# EAGLE design MASTER (EAGLE 7.7.0)
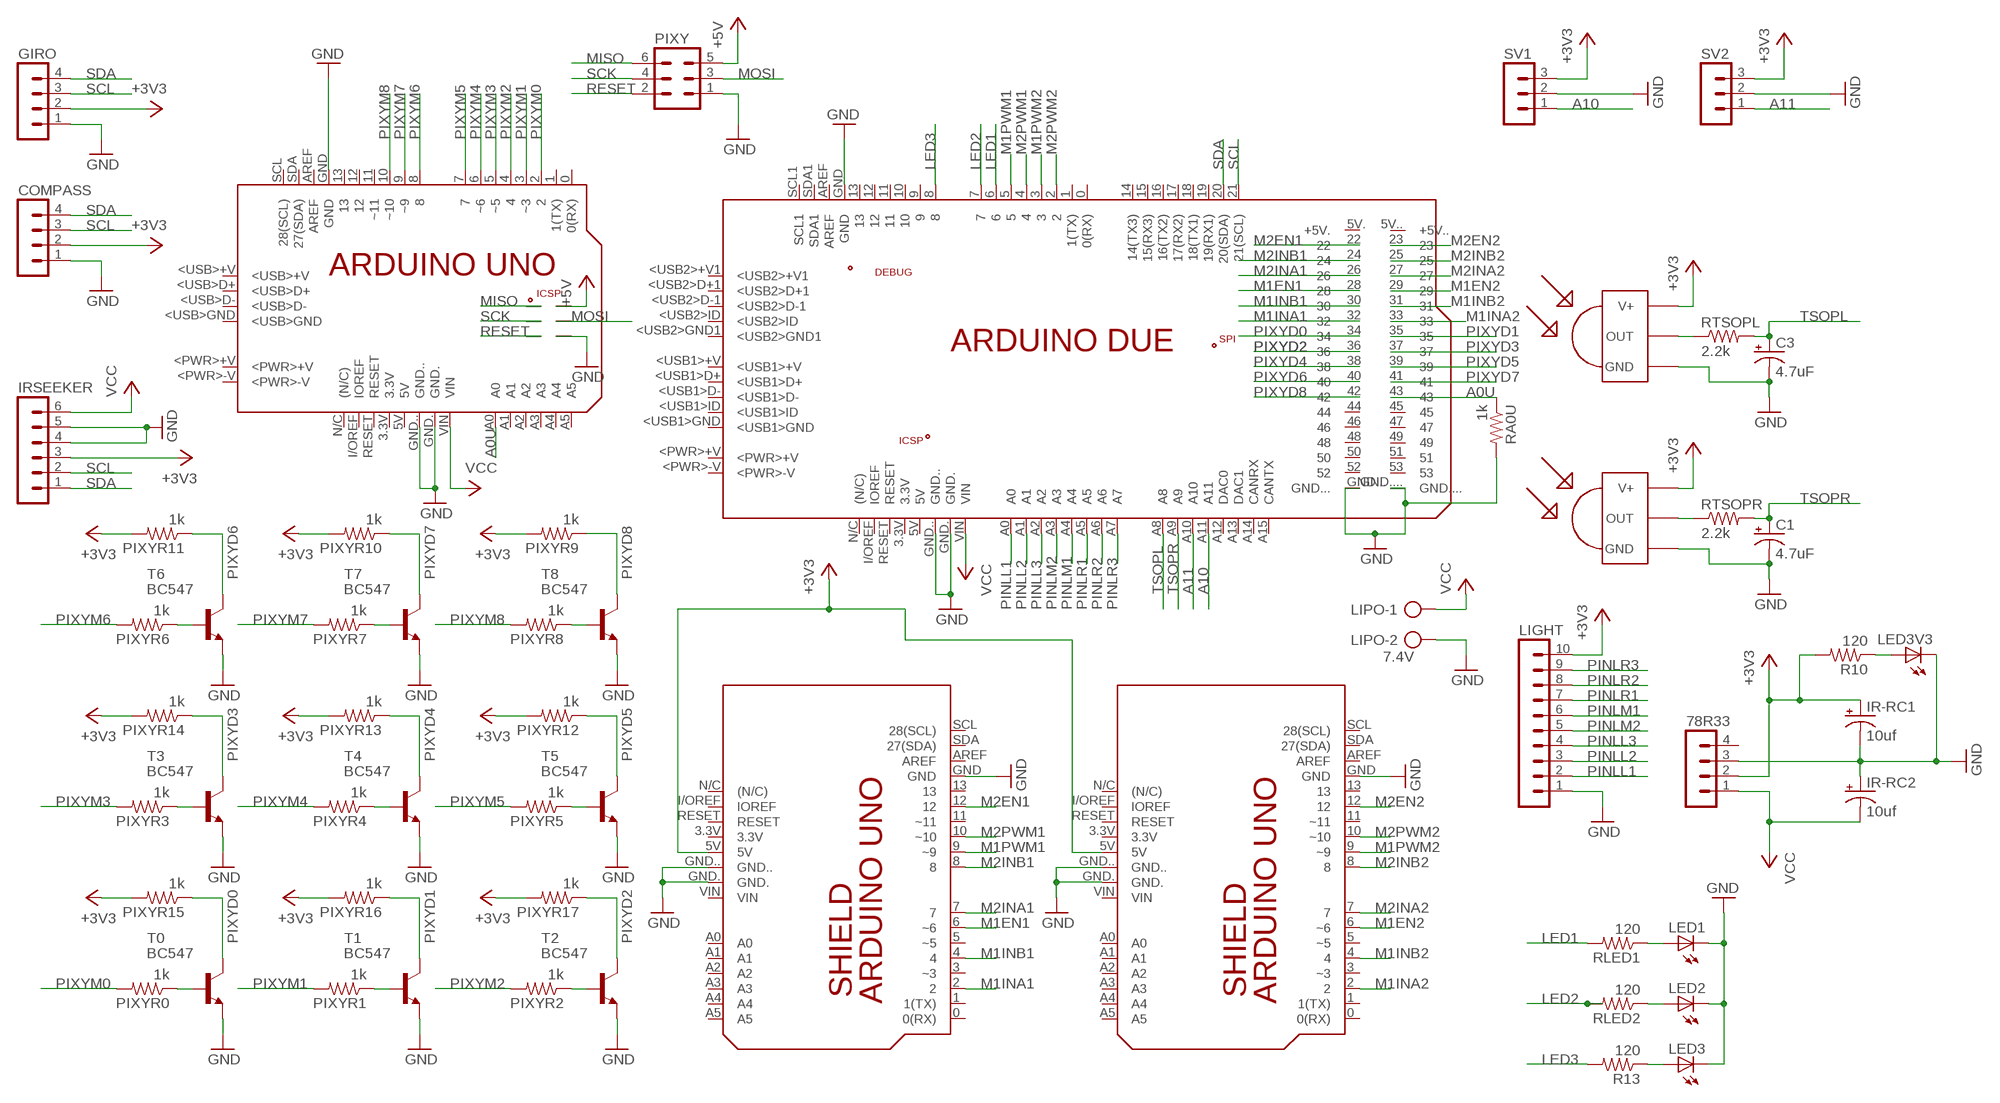
[diagram p0: schematic, sheet 1]

## Parts
78R33  MA04-1  [MA04-1]
C1  4.7uF  CPOL-USE5-6  [E5-6]
C3  4.7uF  CPOL-USE5-6  [E5-6]
COMPASS  MA04-1  [MA04-1]
GIRO  MA04-1  [MA04-1]
IR-RC1  10uf  CPOL-USE5-6  [E5-6]
IR-RC2  10uf  CPOL-USE5-6  [E5-6]
IRSEEKER  MA06-1  [MA06-1]
LED1  LED5MM  [LED5MM]
LED2  LED5MM  [LED5MM]
LED3  LED5MM  [LED5MM]
LED3V3  LED5MM  [LED5MM]
LIGHT  MA10-1  [MA10-1]
LIPO  7.4V  AK500/2  [AK500/2]
PCB3  ARDUINO_DUE  [ARDUINO_DUE]
PCB4  ARDUINO_UNO  [ARDUINO_UNO]
PIXY  MA03-2  [MA03-2]
PIXYR0  1k  R-US_0411/15  [0411/15]
PIXYR1  1k  R-US_0411/15  [0411/15]
PIXYR2  1k  R-US_0411/15  [0411/15]
PIXYR3  1k  R-US_0411/15  [0411/15]
PIXYR4  1k  R-US_0411/15  [0411/15]
PIXYR5  1k  R-US_0411/15  [0411/15]
PIXYR6  1k  R-US_0411/15  [0411/15]
PIXYR7  1k  R-US_0411/15  [0411/15]
PIXYR8  1k  R-US_0411/15  [0411/15]
PIXYR9  1k  R-US_0411/15  [0411/15]
PIXYR10  1k  R-US_0411/15  [0411/15]
PIXYR11  1k  R-US_0411/15  [0411/15]
PIXYR12  1k  R-US_0411/15  [0411/15]
PIXYR13  1k  R-US_0411/15  [0411/15]
PIXYR14  1k  R-US_0411/15  [0411/15]
PIXYR15  1k  R-US_0411/15  [0411/15]
PIXYR16  1k  R-US_0411/15  [0411/15]
PIXYR17  1k  R-US_0411/15  [0411/15]
PUENTE  SHIELD_UNO  [SHIELD_UNO]
PUENTE2  SHIELD_UNO  [SHIELD_UNO]
R10  120  R-US_0411/15  [0411/15]
R13  120  R-US_0411/15  [0411/15]
RA0U  1k  R-US_0411/15  [0411/15]
RLED1  120  R-US_0411/15  [0411/15]
RLED2  120  R-US_0411/15  [0411/15]
RTSOPL  2.2k  R-US_0411/15  [0411/15]
RTSOPR  2.2k  R-US_0411/15  [0411/15]
SV1  MA03-1  [MA03-1]
SV2  MA03-1  [MA03-1]
T0  BC547  [TO92]
T1  BC547  [TO92]
T2  BC547  [TO92]
T3  BC547  [TO92]
T4  BC547  [TO92]
T5  BC547  [TO92]
T6  BC547  [TO92]
T7  BC547  [TO92]
T8  BC547  [TO92]
TSOPL  TSOP2240  [TSOP22XX]
TSOPR  TSOP2240  [TSOP22XX]

## Nets
+3V3: 78R33.2 COMPASS.2 GIRO.2 IR-RC1.+ IRSEEKER.3 LIGHT.10 PIXYR9.2 PIXYR10.2 PIXYR11.2 PIXYR12.2 PIXYR13.2 PIXYR14.2 PIXYR15.2 PIXYR16.2 PIXYR17.2 PUENTE2.5V PUENTE.5V R10.2 SV1.3 SV2.3 TSOPL.VCC(V+) TSOPR.VCC(V+)
+5V: PCB4.+5V PIXY.5
A0U: PCB3.43 PCB4.A0 RA0U.1
A10: PCB3.A11 SV1.1
A11: PCB3.A10 SV2.1
GND: 78R33.3 C1.- C3.- COMPASS.1 GIRO.1 IR-RC1.- IR-RC2.+ IRSEEKER.4 IRSEEKER.5 LED1.K(C) LED2.K(C) LED3.K(C) LED3V3.K(C) LIGHT.1 LIPO.2 PCB3.GND PCB3.GND. PCB3.GND.. PCB3.GND... PCB3.GND.... PCB4.GND PCB4.GND. PCB4.GND.. PCB4.GND_ PIXY.1 PUENTE2.GND PUENTE2.GND. PUENTE2.GND.. PUENTE.GND PUENTE.GND. PUENTE.GND.. RA0U.2 SV1.2 SV2.2 T0.1(E) T1.1(E) T2.1(E) T3.1(E) T4.1(E) T5.1(E) T6.1(E) T7.1(E) T8.1(E) TSOPL.GND TSOPR.GND
LED1: PCB3.6 RLED1.2
LED2: PCB3.7 RLED2.2
LED3: PCB3.8 R13.2
M1EN1: PCB3.28 PUENTE.6(~6)
M1EN2: PCB3.29 PUENTE2.6(~6)
M1INA1: PCB3.32 PUENTE.2
M1INA2: PCB3.33 PUENTE2.2
M1INB1: PCB3.30 PUENTE.4
M1INB2: PCB3.31 PUENTE2.4
M1PWM1: PCB3.5 PUENTE.9(~9)
M1PWM2: PCB3.3 PUENTE2.9(~9)
M2EN1: PCB3.22 PUENTE.12
M2EN2: PCB3.23 PUENTE2.12
M2INA1: PCB3.26 PUENTE.7
M2INA2: PCB3.27 PUENTE2.7
M2INB1: PCB3.24 PUENTE.8
M2INB2: PCB3.25 PUENTE2.8
M2PWM1: PCB3.4 PUENTE.10(~10)
M2PWM2: PCB3.2 PUENTE2.10(~10)
MISO: PCB4.MISO PIXY.6
MOSI: PCB4.MOSI PIXY.3
N$2: RTSOPR.1 TSOPR.OUT
N$4: LED1.A RLED1.1
N$5: RTSOPL.1 TSOPL.OUT
N$7: PIXYR0.1 T0.2(B)
N$8: PIXYR1.1 T1.2(B)
N$9: PIXYR2.1 T2.2(B)
N$10: PIXYR3.1 T3.2(B)
N$11: PIXYR4.1 T4.2(B)
N$12: PIXYR5.1 T5.2(B)
N$13: PIXYR6.1 T6.2(B)
N$14: PIXYR7.1 T7.2(B)
N$15: PIXYR8.1 T8.2(B)
N$19: LED3V3.A R10.1
PINLL1: LIGHT.2 PCB3.A0
PINLL2: LIGHT.3 PCB3.A1
PINLL3: LIGHT.4 PCB3.A2
PINLM1: LIGHT.6 PCB3.A4
PINLM2: LIGHT.5 PCB3.A3
PINLR1: LIGHT.7 PCB3.A5
PINLR2: LIGHT.8 PCB3.A6
PINLR3: LIGHT.9 PCB3.A7
PIXYD0: PCB3.34 PIXYR15.1 T0.3(C)
PIXYD1: PCB3.35 PIXYR16.1 T1.3(C)
PIXYD2: PCB3.36 PIXYR17.1 T2.3(C)
PIXYD3: PCB3.37 PIXYR14.1 T3.3(C)
PIXYD4: PCB3.38 PIXYR13.1 T4.3(C)
PIXYD5: PCB3.39 PIXYR12.1 T5.3(C)
PIXYD6: PCB3.40 PIXYR11.1 T6.3(C)
PIXYD7: PCB3.41 PIXYR10.1 T7.3(C)
PIXYD8: PCB3.42 PIXYR9.1 T8.3(C)
PIXYM0: PCB4.2 PIXYR0.2
PIXYM1: PCB4.3(~3) PIXYR1.2
PIXYM2: PCB4.4 PIXYR2.2
PIXYM3: PCB4.5(~5) PIXYR3.2
PIXYM4: PCB4.6(~6) PIXYR4.2
PIXYM5: PCB4.7 PIXYR5.2
PIXYM6: PCB4.8 PIXYR6.2
PIXYM7: PCB4.9(~9) PIXYR7.2
PIXYM8: PCB4.10(~10) PIXYR8.2
RESET: PCB4.RESET. PIXY.2
RLED2: LED2.A RLED2.1
RLED3: LED3.A R13.1
SCK: PCB4.SCK PIXY.4
SCL: COMPASS.3 GIRO.3 IRSEEKER.2 PCB3.21(21(SCL))
SDA: COMPASS.4 GIRO.4 IRSEEKER.1 PCB3.20(20(SDA))
TSOPL: C3.+ PCB3.A8 RTSOPL.2
TSOPR: C1.+ PCB3.A9 RTSOPR.2
VCC: 78R33.1 IR-RC2.- IRSEEKER.6 LIPO.1 PCB3.VIN PCB4.VIN
Unconnected: 78R33.4 PCB3.0(0(RX)) PCB3.1(1(TX)) PCB3.3.3V PCB3.5V PCB3.5V.(+5V.) PCB3.5V..(+5V..) PCB3.9 PCB3.10 PCB3.11 PCB3.12 PCB3.13 PCB3.14(14(TX3)) PCB3.15(15(RX3)) PCB3.16(16(TX2)) PCB3.17(17(RX2)) PCB3.18(18(TX1)) PCB3.19(19(RX1)) PCB3.44 PCB3.45 PCB3.46 PCB3.47 PCB3.48 PCB3.49 PCB3.50 PCB3.51 PCB3.52 PCB3.53 PCB3.+5V PCB3.+5V_ PCB3.<PWR>+V PCB3.<PWR>-V PCB3.<USB1>+V PCB3.<USB1>D+ PCB3.<USB1>D- PCB3.<USB1>GND PCB3.<USB1>ID PCB3.<USB2>+V1 PCB3.<USB2>D+1 PCB3.<USB2>D-1 PCB3.<USB2>GND1 PCB3.<USB2>ID PCB3.A12(DAC0) PCB3.A13(DAC1) PCB3.A14(CANRX) PCB3.A15(CANTX) PCB3.AREF PCB3.GND1 PCB3.GND_ PCB3.GND__ PCB3.I/OREF(IOREF) PCB3.MISO PCB3.MISO2 PCB3.MOSI PCB3.MOSI2 PCB3.N/C((N/C)) PCB3.RESET PCB3.RESET2 PCB3.RESET. PCB3.RESET.. PCB3.SCK PCB3.SCK2 PCB3.SCL1 PCB3.SDA1 PCB3.SWCLK PCB3.SWDIO PCB4.0(0(RX)) PCB4.1(1(TX)) PCB4.3.3V PCB4.5V PCB4.11(~11) PCB4.12 PCB4.13 PCB4.<PWR>+V PCB4.<PWR>-V PCB4.<USB>+V PCB4.<USB>D+ PCB4.<USB>D- PCB4.<USB>GND PCB4.A1 PCB4.A2 PCB4.A3 PCB4.A4 PCB4.A5 PCB4.AREF PCB4.I/OREF(IOREF) PCB4.N/C((N/C)) PCB4.RESET PCB4.SCL(28(SCL)) PCB4.SDA(27(SDA)) PUENTE2.0(0(RX)) PUENTE2.1(1(TX)) PUENTE2.3(~3) PUENTE2.3.3V PUENTE2.5(~5) PUENTE2.11(~11) PUENTE2.13 PUENTE2.A0 PUENTE2.A1 PUENTE2.A2 PUENTE2.A3 PUENTE2.A4 PUENTE2.A5 PUENTE2.AREF PUENTE2.I/OREF(IOREF) PUENTE2.N/C((N/C)) PUENTE2.RESET PUENTE2.SCL(28(SCL)) PUENTE2.SDA(27(SDA)) PUENTE2.VIN PUENTE.0(0(RX)) PUENTE.1(1(TX)) PUENTE.3(~3) PUENTE.3.3V PUENTE.5(~5) PUENTE.11(~11) PUENTE.13 PUENTE.A0 PUENTE.A1 PUENTE.A2 PUENTE.A3 PUENTE.A4 PUENTE.A5 PUENTE.AREF PUENTE.I/OREF(IOREF) PUENTE.N/C((N/C)) PUENTE.RESET PUENTE.SCL(28(SCL)) PUENTE.SDA(27(SDA)) PUENTE.VIN

## Library data of the parts
78R33 COMPASS GIRO = con-lstb:MA04-1: PIN HEADER; OC_FARNELL: unknown; OC_NEWARK: unknown
C1 C3 IR-RC1 IR-RC2 = rcl:CPOL-US: POLARIZED CAPACITOR, American symbol
IRSEEKER = con-lstb:MA06-1: PIN HEADER; OC_FARNELL: unknown; OC_NEWARK: unknown
LED1-LED3 LED3V3 = led:LED: LED OSRAM: - CHIPLED LG R971, LG N971, LY N971, LG Q971, LY Q971, LO R971, LY R971 LH N974, LH R974 LS Q976, LO Q976, LY Q976 LO Q996 - Hyper CHIPLED LW Q18S LB Q993, LB Q99A, LB R99A - SideLED LS A670, LO A670, LY A670, LG A670, LP A670 LB A673, LV A673, LT A673, LW A673 LH A674 LY A675 LS A676, LA A676, LO A676, LY A676, LW A676 LS A679, LY A679, LG A679 - Hyper Micro SIDELED® LS Y876, LA Y876, LO Y876, LY Y876 LT Y87S - SmartLED LW L88C, LW L88S LB L89C, LB L89S, LG L890 LS L89K, LO L89K, LY L89K LS L896, LA L896, LO L896, LY L896 - TOPLED LS T670, LO T670, LY T670, LG T670, LP T670 LSG T670, LSP T670, LSY T670, LOP T670, LYG T670 LG T671, LOG T671, LSG T671 LB T673, LV T673, LT T673, LW T673 LH T674 LS T676, LA T676, LO T676, LY T676, LB T676, LH T676, LSB T676, LW T676 LB T67C, LV T67C, LT T67C, LS T67K, LO T67K, LY T67K, LW E67C LS E67B, LA E67B, LO E67B, LY E67B, LB E67C, LV E67C, LT E67C LW T67C LS T679, LY T679, LG T679 LS T770, LO T770, LY T770, LG T770, LP T770 LB T773, LV T773, LT T773, LW T773 LH T774 LS E675, LA E675, LY E675, LS T675 LS T776, LA T776, LO T776, LY T776, LB T776 LHGB T686 LT T68C, LB T68C - Hyper Mini TOPLED® LB M676 - Mini TOPLED Santana® LG M470 LS M47K, LO M47K, LY M47K Source: http://www.osram.convergy.de LUXEON: - LUMILED® LXK2-PW12-R00, LXK2-PW12-S00, LXK2-PW14-U00, LXK2-PW14-V00 LXK2-PM12-R00, LXK2-PM12-S00, LXK2-PM14-U00 LXK2-PE12-Q00, LXK2-PE12-R00, LXK2-PE12-S00, LXK2-PE14-T00, LXK2-PE14-U00 LXK2-PB12-K00, LXK2-PB12-L00, LXK2-PB12-M00, LXK2-PB14-N00, LXK2-PB14-P00, LXK2-PB14-Q00 LXK2-PR12-L00, LXK2-PR12-M00, LXK2-PR14-Q00, LXK2-PR14-R00 LXK2-PD12-Q00, LXK2-PD12-R00, LXK2-PD12-S00 LXK2-PH12-R00, LXK2-PH12-S00 LXK2-PL12-P00, LXK2-PL12-Q00, LXK2-PL12-R00 Source: www.luxeon.com KINGBRIGHT: KA-3528ASYC Source: www.kingbright.com
LIGHT = con-lstb:MA10-1: PIN HEADER; OC_FARNELL: unknown; OC_NEWARK: unknown
LIPO = con-ptr500:AK500/2: CONNECTOR; OC_FARNELL: unknown; OC_NEWARK: unknown
PCB3 = E14_Arduino_revC:ARDUINO_DUE: Device for representing an Arduino Due board with a footprint in an EAGLE design. Created by Dave Young for Element14. More EAGLE documentation at: http://www.element14.com/community/community/knode/cadsoft_eagle
PCB4 = E14_Arduino_revC:ARDUINO_UNO: Device for representing an Arduino Uno board with a footprint in an EAGLE design. Created by Dave Young for Element14. More EAGLE documentation at: http://www.element14.com/community/community/knode/cadsoft_eagle
PIXY = con-lstb:MA03-2: PIN HEADER; OC_FARNELL: unknown; OC_NEWARK: unknown
PIXYR0 PIXYR1-PIXYR17 R10 R13 RA0U RLED1 RLED2 RTSOPL RTSOPR = rcl:R-US_: RESISTOR, American symbol
PUENTE PUENTE2 = E14_Arduino_revC:SHIELD_UNO
SV1 SV2 = con-lstb:MA03-1: PIN HEADER; OC_FARNELL: unknown; OC_NEWARK: unknown
T0 T1-T8 = transistor:BC547: NPN TRANSISTOR
TSOPL TSOPR = tsop:TSOP2240: IR Receiver and Demodulator

## Board
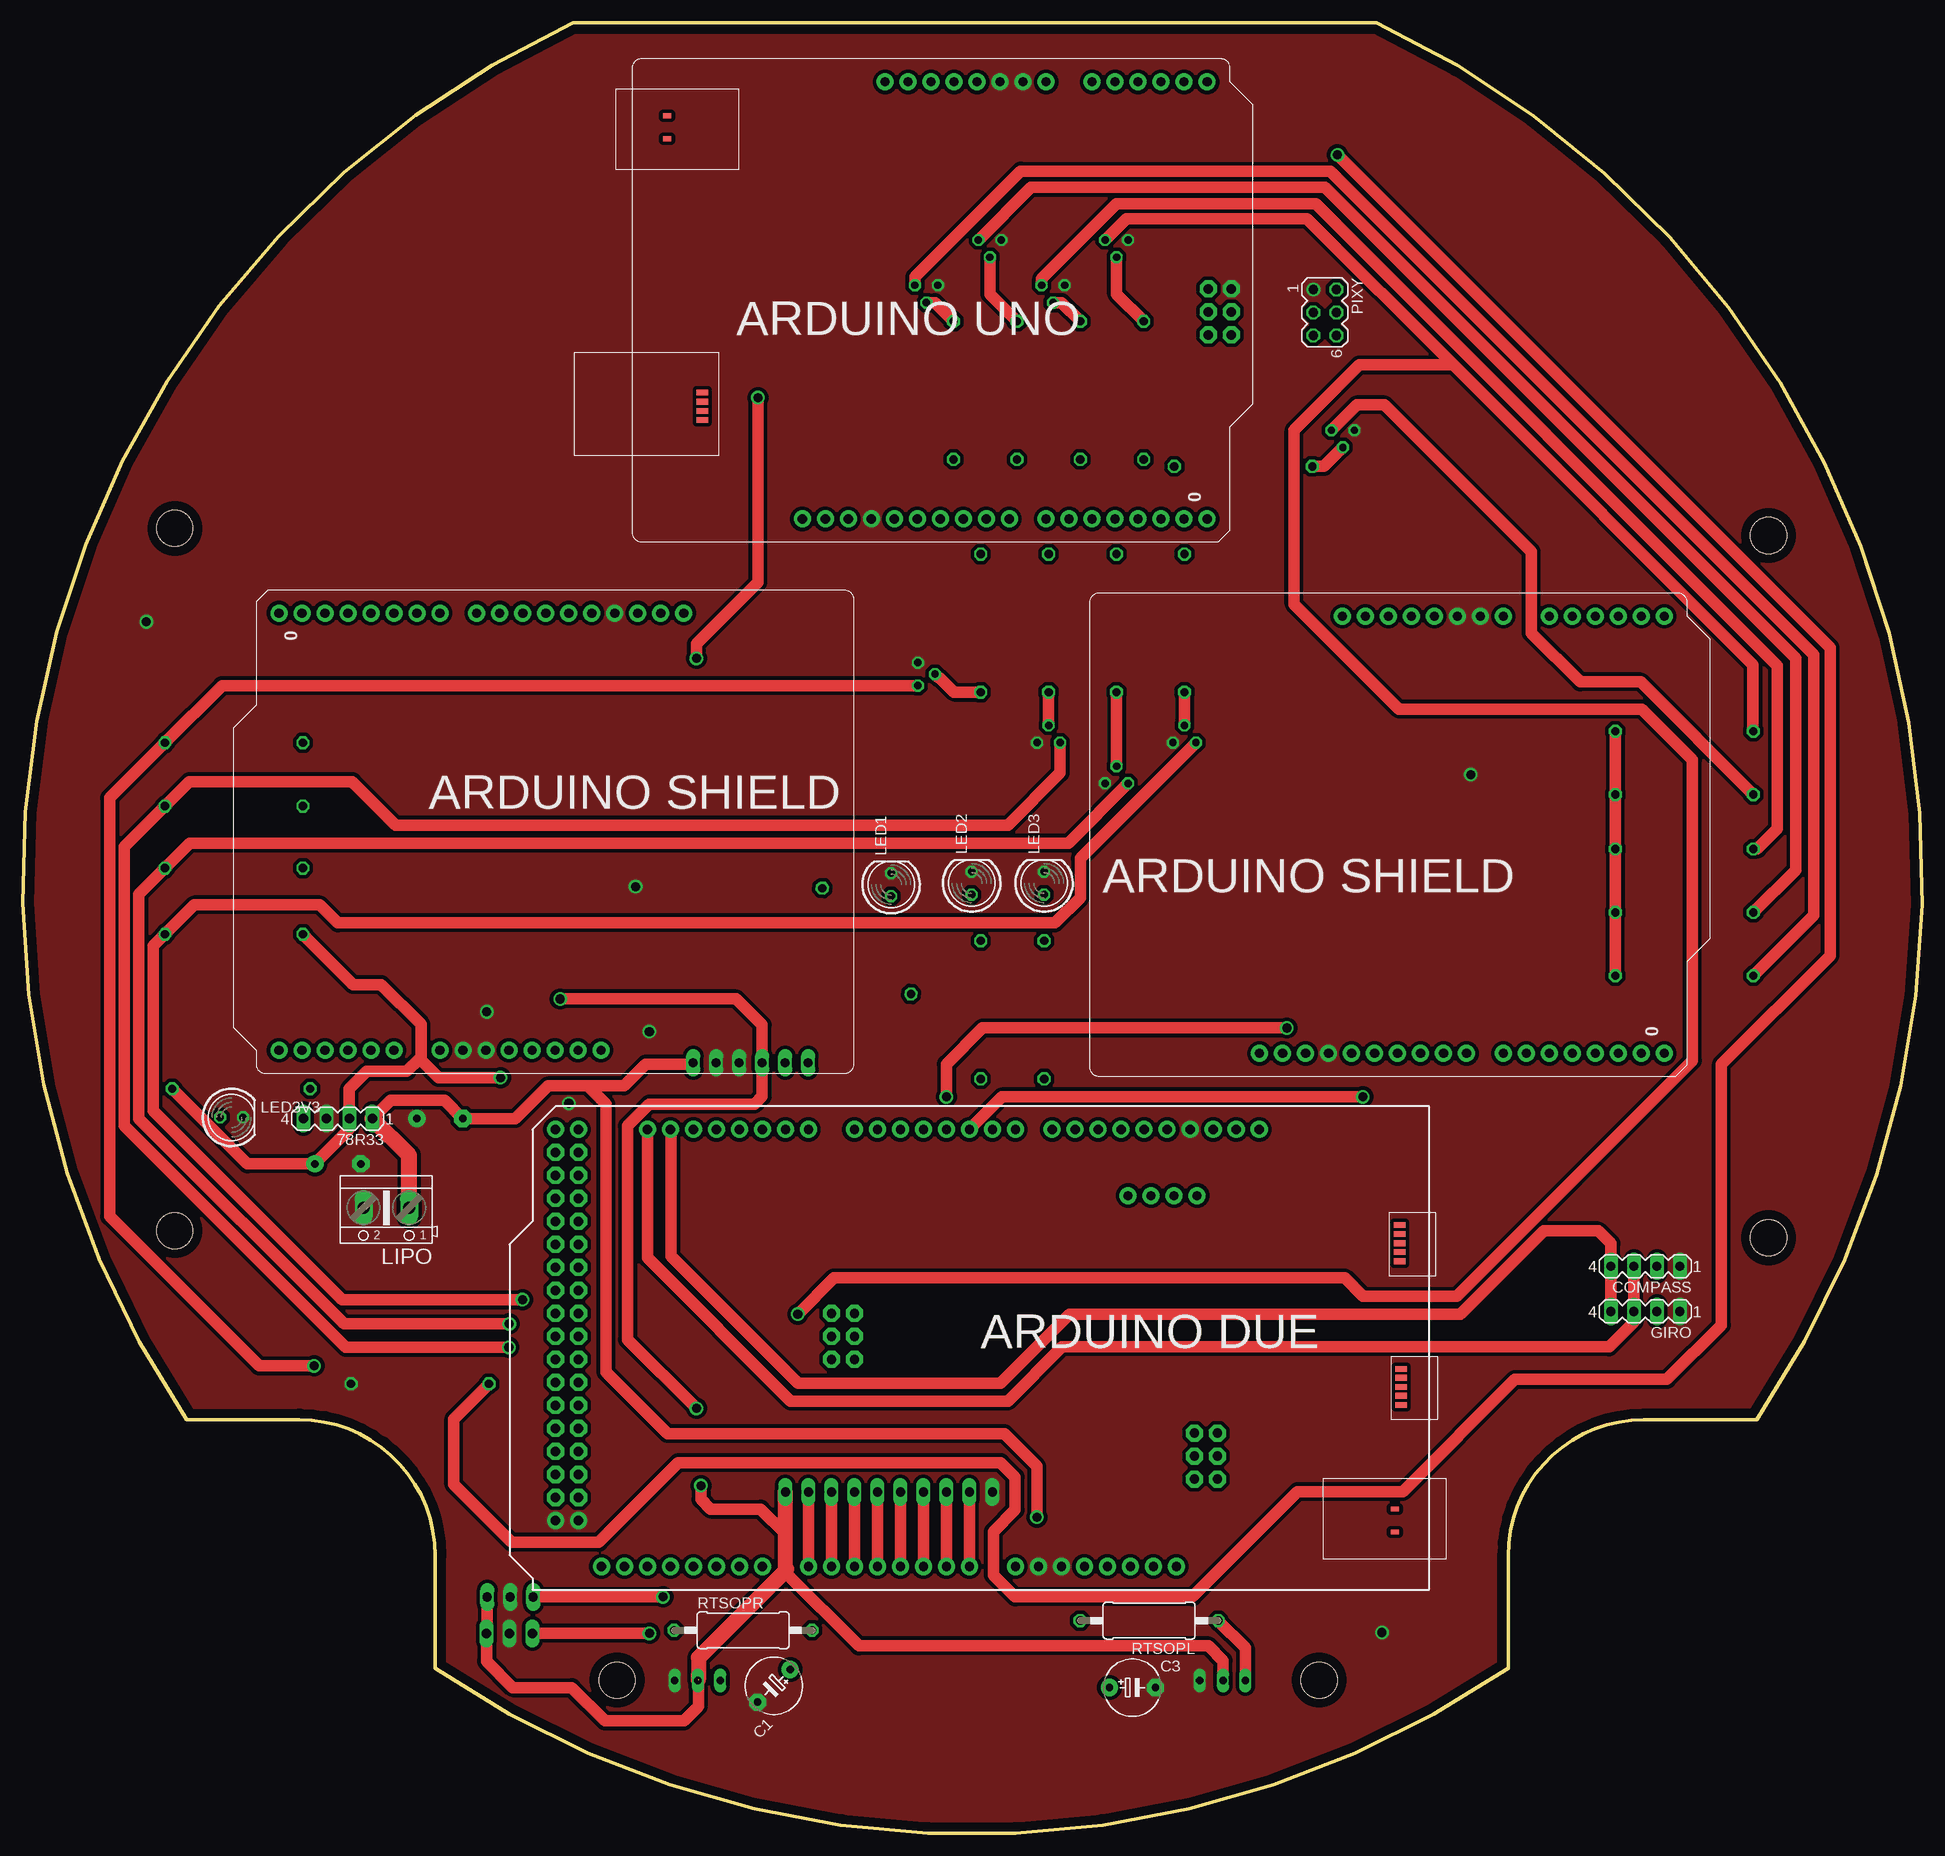
[diagram p1: board, top side]
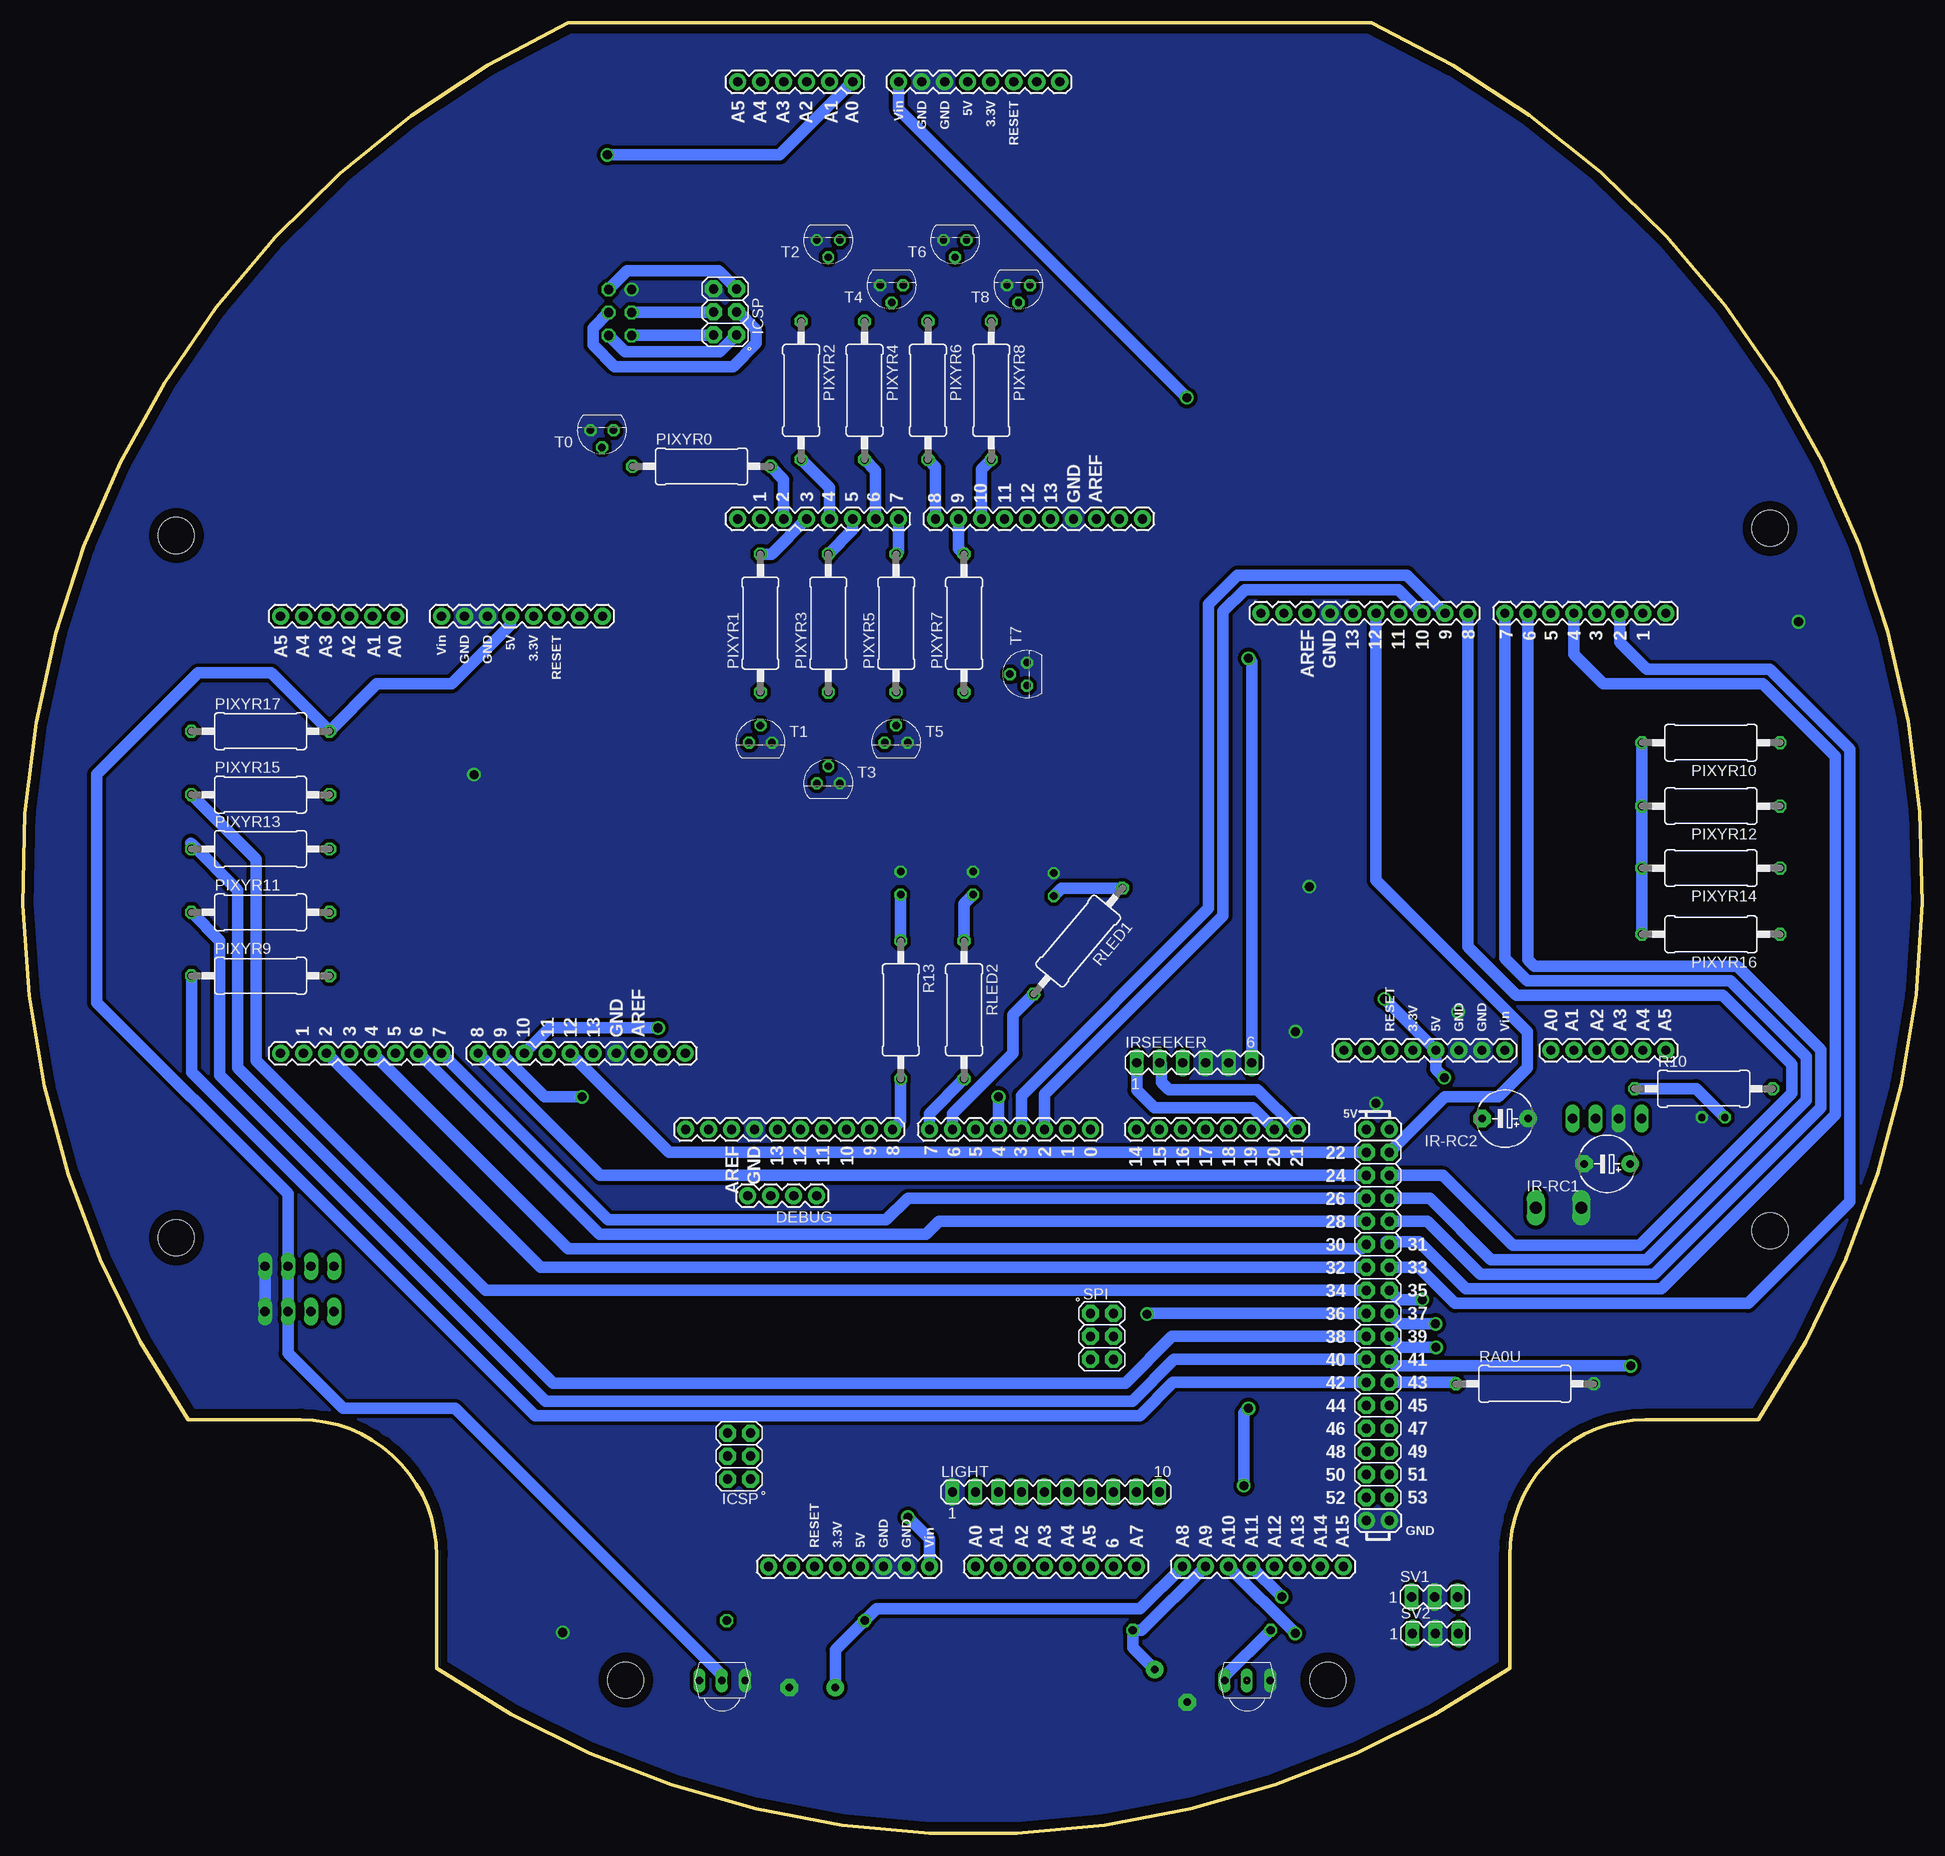
[diagram p2: board, bottom side, seen from below]

Size 209.79 x 199.89 mm. Coordinates in mm from the lower left corner, seen from the top.
Outline: 60.81,199.89 149.53,199.89 arc-99 191.5,45.64 179.06,45.64 arc90 164.06,30.64 164.06,18.2 arc-69 45.56,18.2 45.56,30.64 arc90 30.56,45.64 18.12,45.64 arc-99 60.81,199.89
Copper layers (1*16): Top 0.035mm / dielectric 1.5mm / Bottom 0.035mm
Design rules "default": minimum track width 10mil, minimum drill 24mil, track to track 8mil, track to pad 8mil, pad to pad 8mil, via to via 8mil, smd to smd 8mil, copper to edge 40mil, drill to drill 8mil, minimum pad ring 10mil, minimum via ring 8mil, stop-mask expansion 4mil, vias tented up to drill 0mil, thermal gap 10mil
Holes 4 mm at 16.81,144.05 192.81,143.26 16.81,66.52 192.81,65.73 65.65,16.89 143.18,16.89

### Footprints (pad centres in the part's own frame; a part is rotated, then mirrored left to right if it is on the bottom)
MA04-1 = drill 1.016 long: 1 -3.81,0; 2 -1.27,0; 3 1.27,0; 4 3.81,0
E5-6 = drill 0.813 pad 1.905: + -2.54,0 | drill 0.813 pad 1.905 octagon: - 2.54,0
MA06-1 = drill 1.016 long: 1 -6.35,0; 2 -3.81,0; 3 -1.27,0; 4 1.27,0; 5 3.81,0; 6 6.35,0
LED5MM = drill 0.813 octagon: A -1.27,0; K 1.27,0
MA10-1 = drill 1.016 long: 1 -11.43,0; 2 -8.89,0; 3 -6.35,0; 4 -3.81,0; 5 -1.27,0; 6 1.27,0; 7 3.81,0; 8 6.35,0; 9 8.89,0; 10 11.43,0
AK500/2 = drill 1.321 long: 1 -2.515,0; 2 2.515,0
ARDUINO_DUE = drill 1.016 pad 1.88: 0 -63.451,50.8; 1 -60.911,50.8; 2 -58.371,50.8; 3 -55.831,50.8; 3.3V -35.511,2.54; 4 -53.291,50.8; 5 -50.751,50.8; 5V -38.051,2.54; 5V. -93.931,50.8; 5V.. -96.471,50.8; 6 -48.211,50.8; 7 -45.671,50.8; 8 -41.607,50.8; 9 -39.067,50.8; 10 -36.527,50.8; 11 -33.987,50.8; 12 -31.447,50.8; 13 -28.907,50.8; 14 -68.531,50.8; 15 -71.071,50.8; 16 -73.611,50.8; 17 -76.151,50.8; 18 -78.691,50.8; 19 -81.231,50.8; 20 -83.771,50.8; 21 -86.311,50.8; A0 -50.751,2.54; A1 -53.291,2.54; A2 -55.831,2.54; A3 -58.371,2.54; A4 -60.911,2.54; A5 -63.451,2.54; A6 -65.991,2.54; A7 -68.531,2.54; A8 -73.611,2.54; A9 -76.151,2.54; A10 -78.691,2.54; A11 -81.231,2.54; A12 -83.771,2.54; A13 -86.311,2.54; A14 -88.851,2.54; A15 -91.391,2.54; AREF -23.827,50.8; GND -26.367,50.8; GND1 -33.225,43.485; GND. -43.131,2.54; GND.. -40.591,2.54; GND... -93.931,7.62; GND.... -96.471,7.62; I/OREF -30.431,2.54; N/C -27.891,2.54; RESET -32.971,2.54; RESET.. -25.605,43.485; SCL1 -18.747,50.8; SDA1 -21.287,50.8; SWCLK -30.685,43.485; SWDIO -28.145,43.485; VIN -45.671,2.54 | drill 1.016 pad 1.88 octagon: 22 -93.931,48.26; 23 -96.471,48.26; 24 -93.931,45.72; 25 -96.471,45.72; 26 -93.931,43.18; 27 -96.471,43.18; 28 -93.931,40.64; 29 -96.471,40.64; 30 -93.931,38.1; 31 -96.471,38.1; 32 -93.931,35.56; 33 -96.471,35.56; 34 -93.931,33.02; 35 -96.471,33.02; 36 -93.931,30.48; 37 -96.471,30.48; 38 -93.931,27.94; 39 -96.471,27.94; 40 -93.931,25.4; 41 -96.471,25.4; 42 -93.931,22.86; 43 -96.471,22.86; 44 -93.931,20.32; 45 -96.471,20.32; 46 -93.931,17.78; 47 -96.471,17.78; 48 -93.931,15.24; 49 -96.471,15.24; 50 -93.931,12.7; 51 -96.471,12.7; 52 -93.931,10.16; 53 -96.471,10.16; +5V -25.91,17.272; +5V_ -65.991,30.48; GND_ -25.91,12.192; GND__ -65.991,25.4; MISO -63.451,30.48; MISO2 -23.37,17.272; MOSI -65.991,27.94; MOSI2 -25.91,14.732; RESET2 -23.37,12.192; RESET. -63.451,25.4; SCK -63.451,27.94; SCK2 -23.37,14.732 | smd 1.016 x 0.508: <PWR>+V -3.761,8.89; <PWR>-V -3.761,6.35 | smd 1.27 x 0.635: <USB1>+V -3.05,24.359; <USB1>D+ -3.05,23.368; <USB1>D- -3.05,22.352; <USB1>GND -3.05,20.371; <USB1>ID -3.05,21.387; <USB2>+V1 -3.253,40.234; <USB2>D+1 -3.253,39.243; <USB2>D-1 -3.253,38.227; <USB2>GND1 -3.253,36.246; <USB2>ID -3.253,37.262
ARDUINO_UNO = drill 1.016 pad 1.88: 0 -63.5,50.8; 1 -60.96,50.8; 2 -58.42,50.8; 3 -55.88,50.8; 3.3V -35.56,2.54; 4 -53.34,50.8; 5 -50.8,50.8; 5V -38.1,2.54; 6 -48.26,50.8; 7 -45.72,50.8; 8 -41.656,50.8; 9 -39.116,50.8; 10 -36.576,50.8; 11 -34.036,50.8; 12 -31.496,50.8; 13 -28.956,50.8; A0 -50.8,2.54; A1 -53.34,2.54; A2 -55.88,2.54; A3 -58.42,2.54; A4 -60.96,2.54; A5 -63.5,2.54; AREF -23.876,50.8; GND -26.416,50.8; GND. -43.18,2.54; GND.. -40.64,2.54; I/OREF -30.48,2.54; N/C -27.94,2.54; RESET -33.02,2.54; SCL -18.796,50.8; SDA -21.336,50.8; VIN -45.72,2.54 | drill 1.016 pad 1.88 octagon: +5V -66.167,30.48; GND_ -66.167,25.4; MISO -63.627,30.48; MOSI -66.167,27.94; RESET. -63.627,25.4; SCK -63.627,27.94 | smd 1.016 x 0.508: <PWR>+V -3.861,8.814; <PWR>-V -3.861,6.274 | smd 1.27 x 0.635: <USB>+V -7.772,39.878; <USB>D+ -7.772,38.887; <USB>D- -7.772,37.871; <USB>GND -7.772,36.83
MA03-2 = drill 1.016: 1 -2.54,-1.27 | drill 1.016 octagon: 2 -2.54,1.27; 3 0,-1.27; 4 0,1.27; 5 2.54,-1.27; 6 2.54,1.27
0411/15 = drill 0.914 octagon: 1 -7.62,0; 2 7.62,0
SHIELD_UNO = drill 1.016 pad 1.88: 0 -63.5,50.8; 1 -60.96,50.8; 2 -58.42,50.8; 3 -55.88,50.8; 3.3V -35.56,2.54; 4 -53.34,50.8; 5 -50.8,50.8; 5V -38.1,2.54; 6 -48.26,50.8; 7 -45.72,50.8; 8 -41.656,50.8; 9 -39.116,50.8; 10 -36.576,50.8; 11 -34.036,50.8; 12 -31.496,50.8; 13 -28.956,50.8; A0 -50.8,2.54; A1 -53.34,2.54; A2 -55.88,2.54; A3 -58.42,2.54; A4 -60.96,2.54; A5 -63.5,2.54; AREF -23.876,50.8; GND -26.416,50.8; GND. -43.18,2.54; GND.. -40.64,2.54; I/OREF -30.48,2.54; N/C -27.94,2.54; RESET -33.02,2.54; SCL -18.796,50.8; SDA -21.336,50.8; VIN -45.72,2.54
MA03-1 = drill 1.016 long: 1 -2.54,0; 2 0,0; 3 2.54,0
TO92 = drill 0.813 octagon: 1 1.27,0; 2 0,1.905; 3 -1.27,0
TSOP22XX = drill 0.813 long: GND 3.809,-0.027; OUT -1.231,-0.027; VCC 1.229,-0.027

### Placement (x,y rotation side)
78R33  34.81,78.89 180 top
C1  82.96,16.25 225 top
C3  122.57,16.06 0 top
COMPASS  179.21,62.59 180 top
GIRO  179.21,57.59 180 top
IR-RC1  34.81,73.89 180 bottom
IR-RC2  46.07,78.89 180 bottom
IRSEEKER  80.39,85.06 0 bottom
LED1  95.91,104.72 90 top
LED2  104.81,104.89 90 top
LED3  112.81,104.89 90 top
LED3V3  23.07,79.02 0 top
LIGHT  95.67,37.66 0 bottom
LIPO  40.17,69.04 180 top
PCB3  155.31,26.89 0 top
PCB4  67.31,195.89 180 top
PIXY  143.81,167.89 270 top
PIXYR0  134.81,150.89 0 bottom
PIXYR1  128.31,133.59 90 bottom
PIXYR2  123.81,159.29 270 bottom
PIXYR3  120.81,133.59 90 bottom
PIXYR4  116.81,159.29 270 bottom
PIXYR5  113.31,133.59 90 bottom
PIXYR6  109.81,159.29 270 bottom
PIXYR7  105.81,133.59 90 bottom
PIXYR8  102.81,159.29 270 bottom
PIXYR9  183.52,94.66 0 bottom
PIXYR10  23.33,120.39 180 bottom
PIXYR11  183.52,101.66 0 bottom
PIXYR12  23.33,113.39 180 bottom
PIXYR13  183.52,108.66 0 bottom
PIXYR14  23.33,106.55 180 bottom
PIXYR15  183.52,114.66 0 bottom
PIXYR16  23.33,99.24 180 bottom
PIXYR17  183.52,121.66 0 bottom
PUENTE  117.81,136.89 180 top
PUENTE2  91.81,83.89 0 top
R10  24.13,82.19 0 bottom
R13  112.81,90.89 270 bottom
RA0U  43.88,49.6 0 bottom
RLED1  93.21,98.49 230 bottom
RLED2  105.81,90.89 270 bottom
RTSOPL  124.41,23.46 180 top
RTSOPR  79.57,22.39 0 top
SV1  53.84,26.08 0 bottom
SV2  53.76,22.04 0 bottom
T0  145.81,154.89 180 bottom
T1  128.31,120.39 0 bottom
T2  120.81,175.89 180 bottom
T3  120.81,115.89 0 bottom
T4  113.81,170.89 180 bottom
T5  113.31,120.39 0 bottom
T6  106.81,175.89 180 bottom
T7  98.86,127.96 90 bottom
T8  99.81,170.89 180 bottom
TSOPL  133.81,16.89 0 bottom
TSOPR  75.81,16.89 0 bottom

### Tracks (layer width: path | path; a pad name or v marks a point on that pad's centre or on a via)
+3V3  (via drill 1)  (1 unrouted)
  Top 1.27: TSOPL.VCC 132.58,19.04 130.96,20.66 92.35,20.66 84.24,28.77 84.24,29.68 | PIXYR9.2 PIXYR11.2 PIXYR13.2 PIXYR15.2 PIXYR17.2 | 74.64,17.42 74.64,13.98 73.05,12.39 64.32,12.39 60.64,16.07 54.14,16.07 51.22,18.99 SV2.3 51.3,22.12 SV1.3 | R10.2 24.81,73.89 IR-RC1.+ 36.08,77.7 78R33.2 36.08,82.16 38.01,84.09 42.41,84.09 43.82,85.51 | 43.82,85.51 44.01,85.69 44.01,89.29 39.61,93.69 36.5,93.69 PIXYR16.2 | v59.37,92.09 78.81,92.09 81.66,89.24 IRSEEKER.3 81.66,81.35 80.81,80.49 69.21,80.49 66.81,78.09 66.81,54.49 v74.41,46.89 | 84.24,28.99 84.41,29.15 | v52.78,83.4 45.93,83.4 43.82,85.51 | v74.92,38.36 74.92,36.85 75.99,35.78 81.5,35.78 84.24,33.03
  Top 1.676: 84.24,28.99 74.64,19.38 74.64,17.42 74.64,16.92 | 84.41,29.15 84.24,29.32 84.24,29.68 84.24,33.03 LIGHT.10
  Bottom 1.27: PIXYR10.2 PIXYR12.2 PIXYR14.2 PIXYR16.2 | PUENTE.5V 155.91,133.39 162.41,126.89 170.66,126.89 PIXYR17.2 182.33,128.09 190.41,128.09 201.61,116.89 201.61,91.69 180.48,70.56 COMPASS.2 GIRO.2 180.48,52.96 174.41,46.89 162.01,46.89 132.58,17.46 TSOPL.VCC | v59.37,92.09 PUENTE2.5V 53.71,84.34 v52.78,83.4 | v74.41,46.89 74.92,46.39 v74.92,38.36
+5V
  Bottom 1.27: PIXY.5 133.54,165.35 PCB4.+5V
A0U  (via drill 1)
  Top 1.27: v145.21,185.29 199.61,130.89 199.61,96.89 187.61,84.89 187.61,56.09 181.61,50.09 164.81,50.09 152.41,37.69 140.81,37.69 129.21,26.09 109.61,26.09 107.21,28.49 107.21,33.29 109.61,35.69 109.61,39.29 108.01,40.89 72.41,40.89 63.61,32.09 54.01,32.09 47.61,38.49 47.61,45.71 RA0U.1
  Bottom 1.27: RA0U.1 51.66,49.75 PCB3.43 | v145.21,185.29 126.17,185.29 PCB4.A0
A10  (via drill 1)
  Top 1.27: v70.72,26.08 SV1.1
  Bottom 1.27: v70.72,26.08 PCB3.A11
A11  (via drill 1)
  Top 1.27: v69.23,22.04 SV2.1
  Bottom 1.27: v69.23,22.04 PCB3.A10
GND  (via drill 1)
  Bottom 1.27: GIRO.1 COMPASS.1
  other vias: 69.21,88.49 13.66,133.74 67.7,104.5 150.14,22.15 159.93,116.87 51.25,90.69 60.32,80.56
  pour Top (isolate 0.406, no thermals): -3.19,-3.11 212.81,-3.11 212.81,200.89 -3.19,200.89
  pour Bottom (isolate 0.406, no thermals): -3.19,200.89 212.81,200.89 212.81,-3.11 -3.19,-3.11
LED1
  Bottom 1.27: PCB3.6 107.1,79.4 100.41,86.09 100.41,90.35 RLED1.2
LED2
  Bottom 1.27: RLED2.2 109.64,79.44 PCB3.7
LED3
  Bottom 1.27: R13.2 112.81,78.59 PCB3.8
M1EN1
  Bottom 1.27: PUENTE.6 146.07,66.09 110.01,66.09 108.57,67.53 PCB3.28
M1EN2
  Bottom 1.27: PUENTE2.6 43.55,96.43 42.81,95.69 20.41,95.69 11.21,86.49 11.21,80.09 29.61,61.69 48.81,61.69 54.65,67.53 PCB3.29
M1INA1
  Bottom 1.27: PUENTE.2 152.59,62.45 PCB3.32
M1INA2
  Bottom 1.27: PUENTE2.2 33.39,131.47 30.41,128.49 16.81,128.49 8.01,119.69 8.01,69.69 19.21,58.49 51.61,58.49 55.57,62.45 PCB3.33
M1INB1
  Bottom 1.27: PUENTE.4 149.55,64.49 61.88,64.49 PCB3.30
M1INB2
  Bottom 1.27: PUENTE2.4 38.47,130.15 35.21,126.89 17.61,126.89 9.61,118.89 9.61,79.29 28.81,60.09 50.41,60.09 55.61,65.29 59.21,65.29 58.91,64.99 PCB3.31
M1PWM1  (via drill 1)
  Top 1.27: PCB3.5 108.16,81.29 v148.01,81.29
  Bottom 1.27: PUENTE.9 152.13,81.29 v148.01,81.29
M1PWM2
  Bottom 1.27: PUENTE2.9 56.89,138.89 75.61,138.89 78.81,135.69 78.81,102.09 99.48,81.42 PCB3.3
M2EN1
  Bottom 1.27: PUENTE.12 138.37,75.15 PCB3.22
M2EN2
  Bottom 1.27: PUENTE2.12 60.31,105.2 43.61,88.49 43.61,84.49 46.81,81.29 52.7,81.29 PCB3.23
M2INA1
  Bottom 1.27: PUENTE.7 145.13,67.69 114.41,67.69 112.03,70.07 PCB3.26
M2INA2
  Bottom 1.27: PUENTE2.7 46.09,96.57 43.61,94.09 21.21,94.09 12.81,85.69 12.81,80.89 30.41,63.29 47.61,63.29 54.39,70.07 PCB3.27
M2INB1
  Bottom 1.27: PUENTE.8 145.99,72.61 PCB3.24
M2INB2
  Bottom 1.27: PUENTE2.8 50.15,97.84 44.81,92.49 22.01,92.49 14.41,84.89 14.41,81.69 31.21,64.89 45.21,64.89 52.93,72.61 PCB3.25
M2PWM1  (via drill 1)  (1 unrouted)
  Top 1.27: v139.61,88.89 106.01,88.89 102.01,84.89 v102.01,81.29
  Bottom 1.27: v139.61,88.89 151.59,88.89 PUENTE.10 | v102.01,81.29 PCB3.4
M2PWM2
  Bottom 1.27: PUENTE2.10 57.83,137.29 74.81,137.29 77.21,134.89 77.21,101.29 96.94,81.56 PCB3.2
MISO
  Bottom 1.27: PIXY.6 143.26,163.53 132.82,163.53 PCB4.MISO
MOSI
  Bottom 1.27: PIXY.3 133.54,167.89 PCB4.MOSI
N$2
  Bottom 1.27: RTSOPR.1 77.04,17.3 TSOPR.OUT
N$4
  Bottom 1.27: RLED1.1 95.03,104.33 LED1.A
N$5
  Top 1.27: RTSOPL.1 135.04,20.45 TSOPL.OUT
N$7
  Top 1.27: PIXYR0.1 143.72,150.89 T0.2
N$8
  Top 1.27: PIXYR1.1 T1.2
N$9
  Top 1.27: PIXYR2.1 120.81,169.91 T2.2
N$10
  Top 1.27: PIXYR3.1 T3.2
N$11
  Top 1.27: PIXYR4.1 114.74,168.99 T4.2
N$12
  Top 1.27: PIXYR5.1 T5.2
N$13
  Top 1.27: PIXYR6.1 106.81,169.91 T6.2
N$14
  Top 1.27: T7.2 101.17,127.55 101.28,127.55 102.86,125.97 PIXYR7.1
N$15
  Top 1.27: T8.2 100.74,168.99 PIXYR8.1
N$19
  Bottom 1.27: R10.1 24.97,82.19 LED3V3.A
PINLL1
  Top 1.27: PCB3.A0 LIGHT.2
PINLL2
  Top 1.27: PCB3.A1 LIGHT.3
PINLL3
  Top 1.27: PCB3.A2 LIGHT.4
PINLM1
  Top 1.27: LIGHT.6 PCB3.A4
PINLM2
  Top 1.27: PCB3.A3 LIGHT.5
PINLR1
  Top 1.27: PCB3.A5 LIGHT.7
PINLR2
  Top 1.27: LIGHT.8 PCB3.A6
PINLR3
  Top 1.27: PCB3.A7 LIGHT.9
PIXYD0
  Top 1.27: PIXYR15.1 178.7,127.09 172.01,127.09 166.61,132.49 166.61,141.49 150.41,157.69 147.34,157.69 T0.3
  Bottom 1.27: PCB3.34 158.63,59.91 184.01,85.29 184.01,107.53 PIXYR15.1
PIXYD1  (via drill 1)
  Top 1.27: T1.3 116.81,107.62 116.81,103.29 114.01,100.49 34.81,100.49 32.81,102.49 18.97,102.49 PIXYR16.1 14.44,97.96 14.44,79.77 35.32,58.89 v55.21,58.89
  Bottom 1.27: v55.21,58.89 57.82,58.89 PCB3.35
PIXYD2  (via drill 1)
  Top 1.27: T2.3 121.9,178.25 141.85,178.25 158.01,162.09 | 158.01,162.09 191.1,129 191.1,121.69 PIXYR17.1 | 158.01,162.09 147.61,162.09 140.41,154.89 140.41,135.69 152.01,124.09 178.81,124.09 184.41,118.49 184.41,85.29 158.41,59.29 148.01,59.29 146.01,61.29 89.61,61.29 v85.61,57.29
  Bottom 1.27: PCB3.36 85.53,57.37 v85.61,57.29
PIXYD3  (via drill 1)
  Top 1.27: T3.3 115.48,109.29 18.46,109.29 PIXYR14.1 12.81,103.64 12.81,78.89 35.48,56.22 v53.74,56.22
  Bottom 1.27: v53.74,56.22 57.69,56.22 PCB3.37
PIXYD4
  Top 1.27: T4.3 112.54,171.62 120.81,179.89 142.81,179.89 193.81,128.89 193.81,110.89 191.58,108.66 PIXYR13.1
  Bottom 1.27: PCB3.38 82.87,54.83 88.01,49.69 151.21,49.69 186.01,84.49 186.01,104.09 191.14,109.22 | 191.21,109.29 191.14,109.22 | 191.14,109.22 PIXYR13.1
PIXYD5  (via drill 1)
  Top 1.27: T5.3 114.58,117.06 108.81,111.29 41.21,111.29 36.41,116.09 18.41,116.09 PIXYR12.1 11.21,108.89 11.21,78.09 35.68,53.62 v53.7,53.62
  Bottom 1.27: v53.7,53.62 57.63,53.62 PCB3.39
PIXYD6
  Top 1.27: T6.3 111.34,181.69 143.81,181.69 195.81,129.69 195.81,106.33 PIXYR11.1
  Bottom 1.27: PCB3.40 82.61,52.29 87.21,47.69 152.01,47.69 188.01,83.69 188.01,98.53 PIXYR11.1
PIXYD7  (via drill 1)
  Top 1.27: T7.3 22.01,126.69 PIXYR10.1 9.61,114.29 9.61,68.09 26.12,51.58 v32.19,51.58
  Bottom 1.27: v32.19,51.58 58.13,51.58 PCB3.41
PIXYD8
  Top 1.27: T8.3 98.54,171.82 110.21,183.49 144.41,183.49 197.81,130.09 197.81,101.33 PIXYR9.1
  Bottom 1.27: PCB3.42 82.75,49.75 86.41,46.09 153.21,46.09 191.14,84.02 PIXYR9.1
PIXYM0
  Bottom 1.27: PCB4.2 125.73,149.43 PIXYR0.2
PIXYM1
  Bottom 1.27: PIXYR1.2 127.07,141.21 PCB4.3
PIXYM2
  Bottom 1.27: PIXYR2.2 120.65,148.51 PCB4.4
PIXYM3
  Bottom 1.27: PIXYR3.2 118.11,143.91 PCB4.5
PIXYM4
  Bottom 1.27: PIXYR4.2 115.57,150.43 PCB4.6
PIXYM5
  Bottom 1.27: PIXYR5.2 113.03,141.49 PCB4.7
PIXYM6
  Bottom 1.27: PIXYR6.2 108.97,150.83 PCB4.8
PIXYM7
  Bottom 1.27: PIXYR7.2 106.43,141.83 PCB4.9
PIXYM8
  Bottom 1.27: PIXYR8.2 103.89,150.6 PCB4.10
RESET
  Bottom 1.27: PIXY.2 143.01,172.5 132.95,172.5 PCB4.RESET.
RLED2
  Bottom 1.27: RLED2.1 105.81,102.62 LED2.A
RLED3
  Bottom 1.27: R13.1 LED3.A
SCK
  Bottom 1.27: PCB4.SCK 130.72,167.95 128.76,165.99 128.76,164.5 131.34,161.92 144.41,161.92 146.8,164.31 146.8,166.17 PIXY.4
SCL
  Top 1.27: PCB3.21 69,63.5 84.81,47.69 108.81,47.69 114.81,53.69 175.21,53.69 177.94,56.42 GIRO.3 COMPASS.3
  Bottom 1.27: PCB3.21 73.4,82.09 83.21,82.09 84.01,82.89 84.01,84.87 IRSEEKER.2
SDA
  Top 1.27: PCB3.20 71.61,77.62 71.61,63.69 85.61,49.69 108.01,49.69 115.61,57.29 158.81,57.29 168.01,66.49 174.01,66.49 175.4,65.1 COMPASS.4 GIRO.4
  Bottom 1.27: IRSEEKER.1 86.74,82.03 84.81,80.09 73.94,80.09 PCB3.20
TSOPL
  Bottom 1.27: C3.+ 120.03,20.23 RTSOPL.2 115.51,24.74 86.39,24.74 PCB3.A8
TSOPR
  Bottom 1.27: C1.+ 87.19,20.48 RTSOPR.2 86.2,22.39 PCB3.A9
VCC  (via drill 1)
  Top 1.27: 78R33.1 40.62,80.89 46.61,80.89 IR-RC2.- 54.41,78.89 58.01,82.49 62.41,82.49 | 62.41,82.49 64.41,80.49 64.41,50.89 71.21,44.09 108.41,44.09 112.01,40.49 v112.01,34.89 | v74.41,129.69 74.41,131.29 81.21,138.09 v81.21,158.49 | IRSEEKER.6 74.04,84.89 68.81,84.89 66.41,82.49 62.41,82.49
  Top 1.778: LIPO.1 42.68,74.83 78R33.1
  Bottom 1.27: IRSEEKER.6 74.04,129.33 v74.41,129.69 | v81.21,158.49 113.03,190.31 PCB4.VIN | v112.01,34.89 109.64,32.52 PCB3.VIN

### Text on the board
200bmp: C:/Users/Sony Vaio/Documents/eagle/TMR2017/MASTER/yoHagoRobots.bmp